# EAGLE design main (EAGLE 6.5.0)
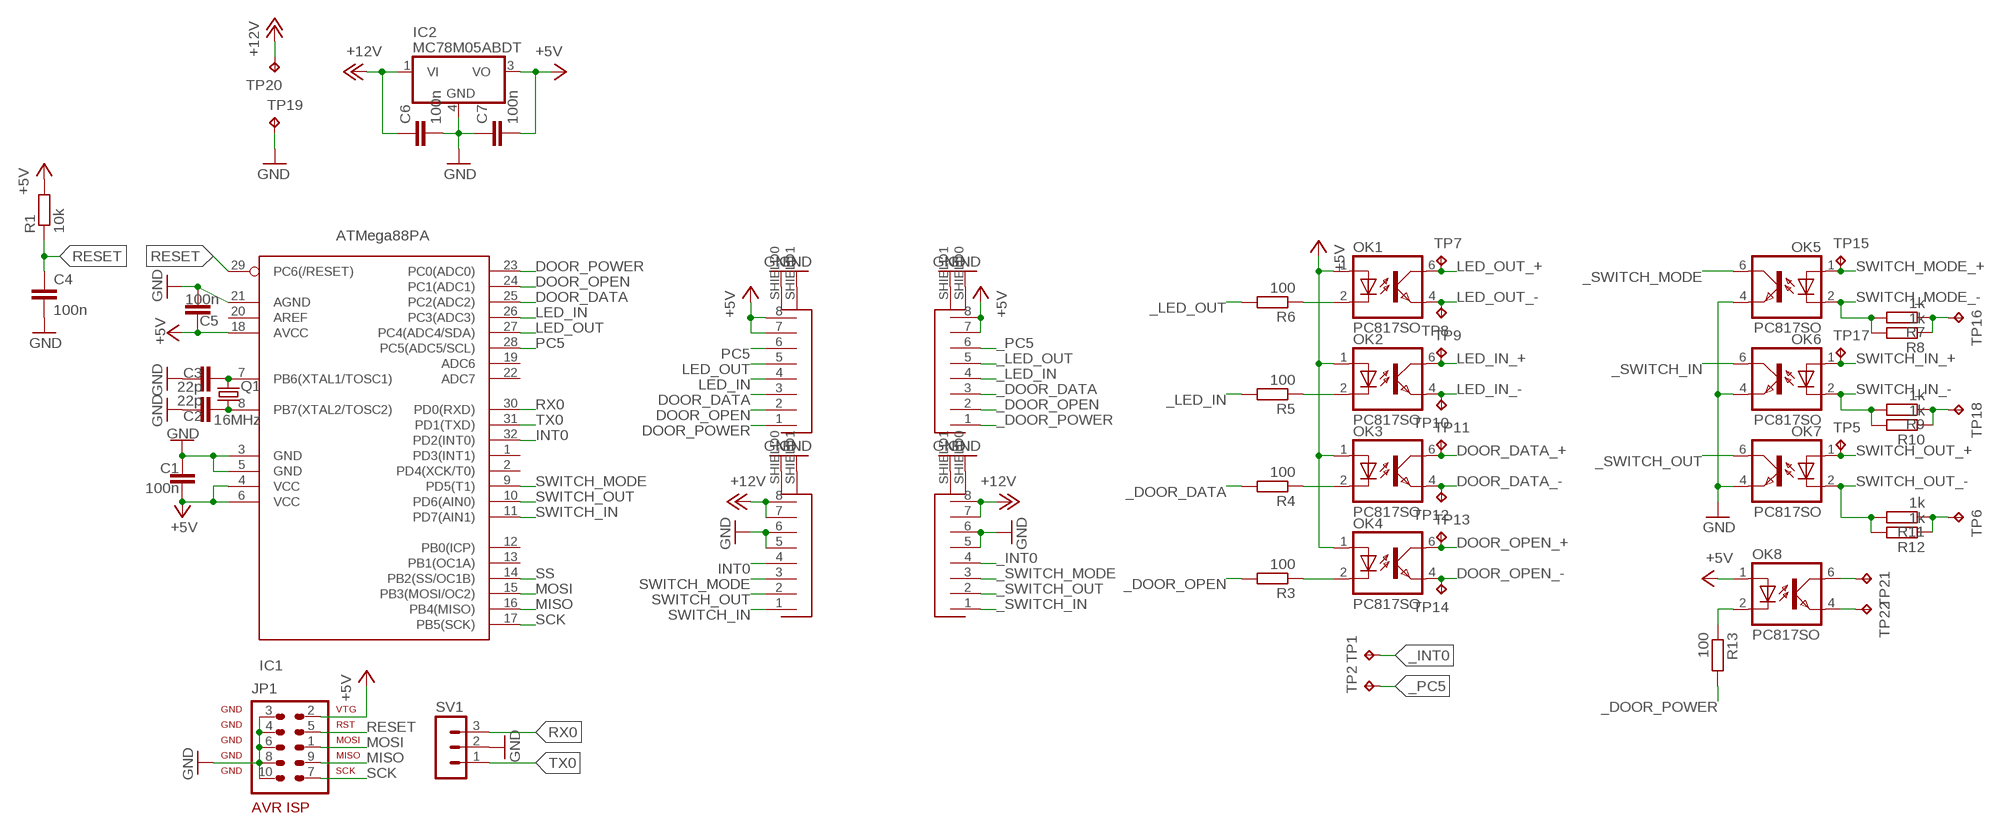
[diagram p0: schematic, sheet 1]

## Parts
C1  100n  C-EUC0805  [C0805]
C2  22p  C-EUC0805  [C0805]
C3  22p  C-EUC0805  [C0805]
C4  100n  C-EUC0805  [C0805]
C5  100n  C-EUC0805  [C0805]
C6  100n  C-EUC0805  [C0805]
C7  100n  C-EUC0805  [C0805]
CON1  451000  [451000]
CON1_  451000  [451000]
CON2  451000  [451000]
CON2_  451000  [451000]
IC1  ATMega88PA  MEGA8-AI  [TQFP32-08]
IC2  MC78M05ABDT  [DPACK_3]
JP1  AVR-ISP-10  [AVR-ISP-10]
OK1  PC817SO  [SO4]
OK2  PC817SO  [SO4]
OK3  PC817SO  [SO4]
OK4  PC817SO  [SO4]
OK5  PC817SO  [SO4]
OK6  PC817SO  [SO4]
OK7  PC817SO  [SO4]
OK8  PC817SO  [SO4]
Q1  16MHz  CRYSTALMQ  [MQ]
R1  10k  R-EU_M0805  [M0805]
R3  100  R-EU_M0805  [M0805]
R4  100  R-EU_M0805  [M0805]
R5  100  R-EU_M0805  [M0805]
R6  100  R-EU_M0805  [M0805]
R7  1k  R-EU_M0805  [M0805]
R8  1k  R-EU_M0805  [M0805]
R9  1k  R-EU_M0805  [M0805]
R10  1k  R-EU_M0805  [M0805]
R11  1k  R-EU_M0805  [M0805]
R12  1k  R-EU_M0805  [M0805]
R13  100  R-EU_M0805  [M0805]
SV1  MA03-1  [MA03-1]
TP1  TPTP20SQ  [TP20SQ]
TP2  TPTP20SQ  [TP20SQ]
TP5  TPTP20SQ  [TP20SQ]
TP6  TPTP20SQ  [TP20SQ]
TP7  TPTP20SQ  [TP20SQ]
TP8  TPTP20SQ  [TP20SQ]
TP9  TPTP20SQ  [TP20SQ]
TP10  TPTP20SQ  [TP20SQ]
TP11  TPTP20SQ  [TP20SQ]
TP12  TPTP20SQ  [TP20SQ]
TP13  TPTP20SQ  [TP20SQ]
TP14  TPTP20SQ  [TP20SQ]
TP15  TPTP20SQ  [TP20SQ]
TP16  TPTP20SQ  [TP20SQ]
TP17  TPTP20SQ  [TP20SQ]
TP18  TPTP20SQ  [TP20SQ]
TP19  TPTP20SQ  [TP20SQ]
TP20  TPTP20SQ  [TP20SQ]
TP21  TPTP20SQ  [TP20SQ]
TP22  TPTP20SQ  [TP20SQ]

## Nets
+5V: C1.1 C5.1 C7.2 CON2.7 CON2.8 CON2_.7 CON2_.8 IC1.4(VCC) IC1.6(VCC) IC1.18(AVCC) IC2.3(VO) JP1.2 OK1.1(A) OK2.1(A) OK3.1(A) OK4.1(A) OK8.1(A) R1.2
+12V: C6.1 CON1.7 CON1.8 CON1_.7 CON1_.8 IC2.1(VI) TP20.TP
_DOOR_DATA: CON2_.3 R4.2
_DOOR_OPEN: CON2_.2 R3.2
_DOOR_POWER: CON2_.1 R13.2
_INT0: CON1_.4 TP1.TP
_LED_IN: CON2_.4 R5.2
_LED_OUT: CON2_.5 R6.2
_PC5: CON2_.6 TP2.TP
_SWITCH_IN: CON1_.1 OK6.6(COL)
_SWITCH_MODE: CON1_.3 OK5.6(COL)
_SWITCH_OUT: CON1_.2 OK7.6(COL)
DOOR_DATA: CON2.3 IC1.25(PC2(ADC2))
DOOR_DATA_+: OK3.6(COL) TP11.TP
DOOR_DATA_-: OK3.4(EMIT) TP12.TP
DOOR_OPEN: CON2.2 IC1.24(PC1(ADC1))
DOOR_OPEN_+: OK4.6(COL) TP13.TP
DOOR_OPEN_-: OK4.4(EMIT) TP14.TP
DOOR_POWER: CON2.1 IC1.23(PC0(ADC0))
GND: C1.2 C2.1 C3.1 C4.2 C5.2 C6.2 C7.1 CON1.5 CON1.6 CON1.SHIELD0 CON1.SHIELD1 CON1_.5 CON1_.6 CON1_.SHIELD0 CON1_.SHIELD1 CON2.SHIELD0 CON2.SHIELD1 CON2_.SHIELD0 CON2_.SHIELD1 IC1.3(GND) IC1.5(GND) IC1.21(AGND) IC2.4(GND) JP1.3 JP1.4 JP1.6 JP1.8 JP1.10 OK5.4(EMIT) OK6.4(EMIT) OK7.4(EMIT) SV1.2 TP19.TP
INT0: CON1.4 IC1.32(PD2(INT0))
LED_IN: CON2.4 IC1.26(PC3(ADC3))
LED_IN_+: OK2.6(COL) TP9.TP
LED_IN_-: OK2.4(EMIT) TP10.TP
LED_OUT: CON2.5 IC1.27(PC4(ADC4/SDA))
LED_OUT_+: OK1.6(COL) TP7.TP
LED_OUT_-: OK1.4(EMIT) TP8.TP
MISO: IC1.16(PB4(MISO)) JP1.9
MOSI: IC1.15(PB3(MOSI/OC2)) JP1.1
N$1: OK8.2(C) R13.1
N$2: OK4.2(C) R3.1
N$3: C3.2 IC1.7(PB6(XTAL1/TOSC1)) Q1.P3
N$4: C2.2 IC1.8(PB7(XTAL2/TOSC2)) Q1.P1
N$5: OK3.2(C) R4.1
N$6: OK2.2(C) R5.1
N$7: OK1.2(C) R6.1
N$10: R7.1 R8.1 TP16.TP
N$11: R11.1 R12.1 TP6.TP
N$12: R9.1 R10.1 TP18.TP
N$13: OK8.6(COL) TP21.TP
N$14: OK8.4(EMIT) TP22.TP
PC5: CON2.6 IC1.28(PC5(ADC5/SCL))
RESET: C4.1 IC1.29(PC6(/RESET)) JP1.5 R1.1
RX0: IC1.30(PD0(RXD)) SV1.3
SCK: IC1.17(PB5(SCK)) JP1.7
SS: IC1.14(PB2(SS/OC1B))
SWITCH_IN: CON1.1 IC1.11(PD7(AIN1))
SWITCH_IN_+: OK6.1(A) TP17.TP
SWITCH_IN_-: OK6.2(C) R9.2 R10.2
SWITCH_MODE: CON1.3 IC1.9(PD5(T1))
SWITCH_MODE_+: OK5.1(A) TP15.TP
SWITCH_MODE_-: OK5.2(C) R7.2 R8.2
SWITCH_OUT: CON1.2 IC1.10(PD6(AIN0))
SWITCH_OUT_+: OK7.1(A) TP5.TP
SWITCH_OUT_-: OK7.2(C) R11.2 R12.2
TX0: IC1.31(PD1(TXD)) SV1.1
Unconnected: IC1.1(PD3(INT1)) IC1.2(PD4(XCK/T0)) IC1.12(PB0(ICP)) IC1.13(PB1(OC1A)) IC1.19(ADC6) IC1.20(AREF) IC1.22(ADC7) Q1.P2(GND) Q1.P4(GND1)

## Library data of the parts
C1-C7 = rcl:C-EU: CAPACITOR, European symbol
CON1 CON1_ CON2 CON2_ = pollin:451000
IC1 = avr-7:MEGA8: MICROCONTROLLER 8 Kbytes FLASH 1 kbytes SRAM 512 bytes EEPROM USART 6-channel 10 bit ADC 2-channel 8 bit ADC
IC2 = linear:MC78M: 500 mA Positive Voltage Regulators Source: Data sheet <http://www.onsemi.com/pub_link/Collateral/MC78M00-D.PDF>
JP1 = avr-7:AVR-ISP-10: AVR ISP-10 Serial Programming Header
OK1-OK8 = optocoupler2:PC817: SHARP OPTO COUPLER
Q1 = crystal2:CRYSTAL
R1 R3-R13 = rcl:R-EU_: RESISTOR, European symbol
SV1 = con-lstb:MA03-1: PIN HEADER; OC_FARNELL: unknown; OC_NEWARK: unknown
TP1 TP2 TP5-TP22 = testpad:TP: Test pad

## Board
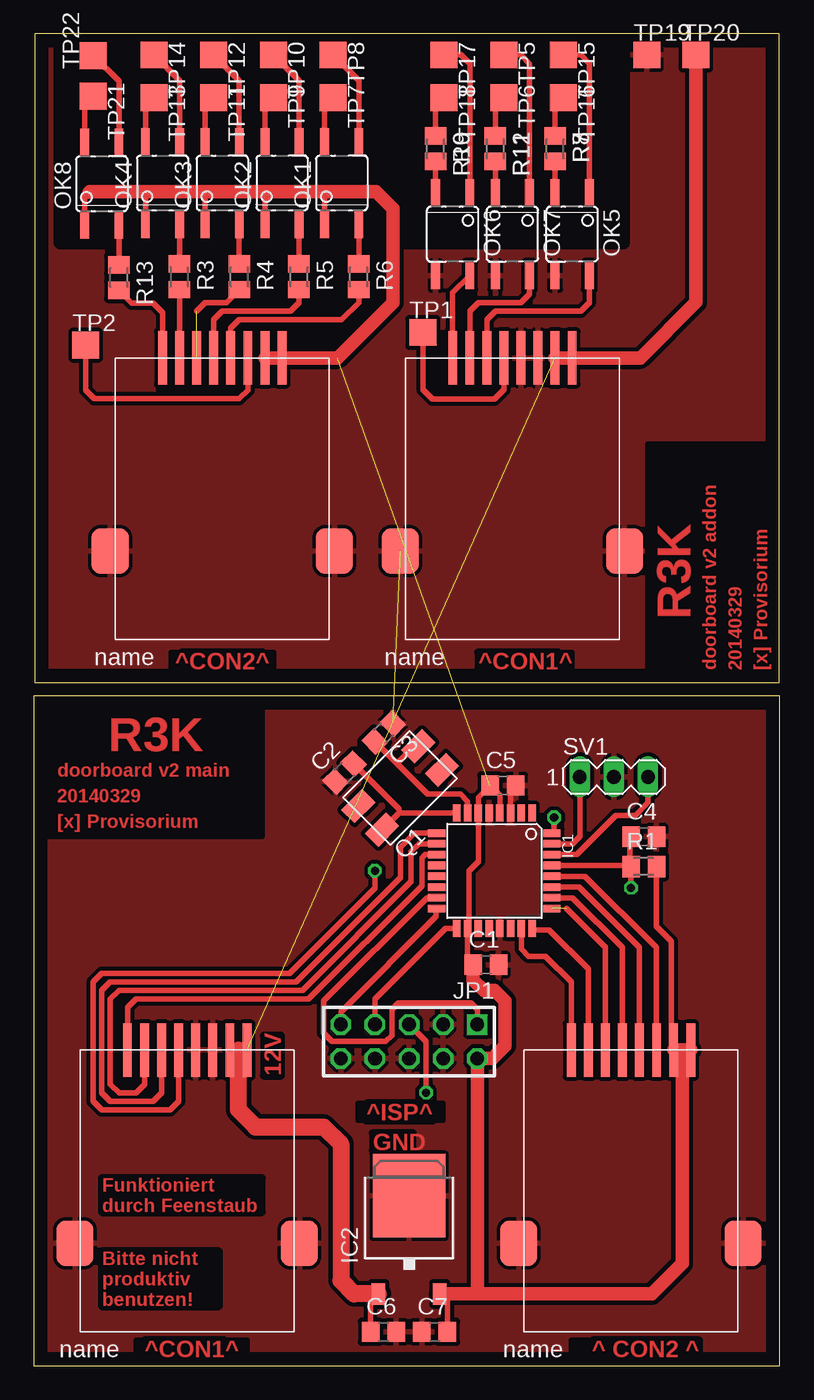
[diagram p1: board, top side]
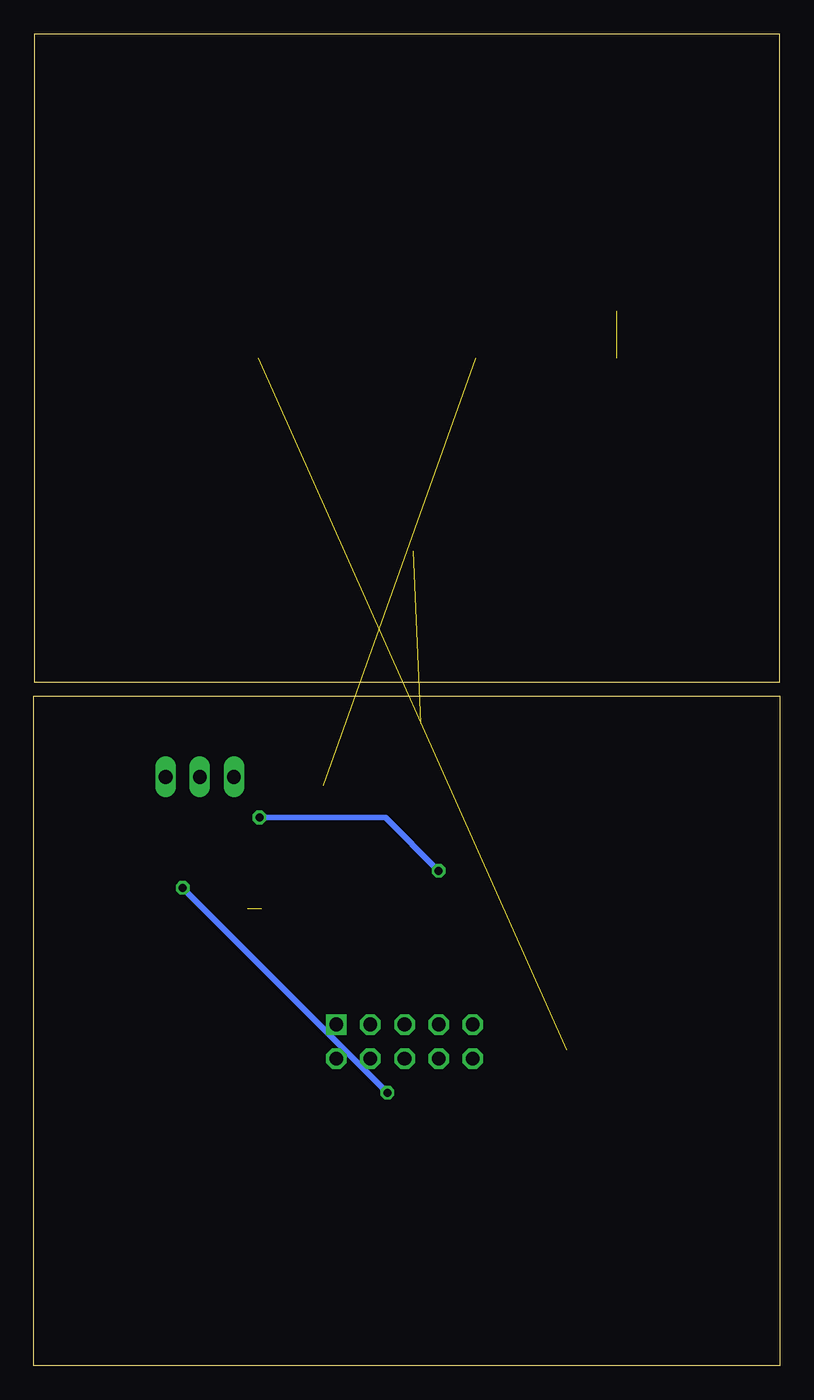
[diagram p2: board, bottom side, seen from below]

Size 55.54 x 99.11 mm. Coordinates in mm from the lower left corner, seen from the top.
Outline: 0,0 55.54,0 55.54,49.84 0,49.84 0,0
Outline: 0.07,50.85 55.47,50.85 55.47,99.11 0.07,99.11 0.07,50.85
Copper layers (1*16): Top 0.035mm / dielectric 1.5mm / Bottom 0.035mm
Design rules "default *": minimum track width 10mil, minimum drill 24mil, track to track 12mil, track to pad 12mil, pad to pad 12mil, via to via 16mil, smd to smd 8mil, copper to edge 40mil, drill to drill 8mil, minimum pad ring 10mil, minimum via ring 8mil, stop-mask expansion 4mil, vias tented up to drill 0mil, thermal gap 10mil
tRestrict: area 1.1,39.4 to 17,48.9; area 40,0.6 to 49.5,1.9; area 7.6,0.6 to 15.9,1.9; area 24.1,18.3 to 30.5,19.5; area 10.2,51.8 to 17.8,53.1; area 33.1,51.8 to 40.1,53.1; area 2,83.6 to 43.9,98.3; area 45.7,51.1 to 55.2,68.6

### Footprints (pad centres in the part's own frame; a part is rotated, then mirrored left to right if it is on the bottom)
C0805 = smd 1.3 x 1.5: 1 -0.95,0; 2 0.95,0
451000 = smd 0.66 x 3.962: 1 -4.445,4.445; 2 -3.175,4.445; 3 -1.905,4.445; 4 -0.635,4.445; 5 0.635,4.445; 6 1.905,4.445; 7 3.175,4.445; 8 4.445,4.445 | smd 2.769 x 3.378: SHIELD0 -8.344,-9.931; SHIELD1 8.344,-9.931
TQFP32-08 = smd 1.27 x 0.559: 1 -4.293,2.8; 2 -4.293,2; 3 -4.293,1.2; 4 -4.293,0.4; 5 -4.293,-0.4; 6 -4.293,-1.2; 7 -4.293,-2; 8 -4.293,-2.8; 17 4.293,-2.8; 18 4.293,-2; 19 4.293,-1.2; 20 4.293,-0.4; 21 4.293,0.4; 22 4.293,1.2; 23 4.293,2; 24 4.293,2.8 | smd 0.559 x 1.27: 9 -2.8,-4.293; 10 -2,-4.293; 11 -1.2,-4.293; 12 -0.4,-4.293; 13 0.4,-4.293; 14 1.2,-4.293; 15 2,-4.293; 16 2.8,-4.293; 25 2.8,4.293; 26 2,4.293; 27 1.2,4.293; 28 0.4,4.293; 29 -0.4,4.293; 30 -1.2,4.293; 31 -2,4.293; 32 -2.8,4.293
DPACK_3 = smd 1 x 1.6: 1 -2.28,-4.8; 3 2.28,-4.8 | smd 5.4 x 6.2: 4 0,2.5
AVR-ISP-10 = drill 1.016 square: 1 -5.08,-1.27 | drill 1.016 octagon: 2 -5.08,1.27; 3 -2.54,-1.27; 4 -2.54,1.27; 5 0,-1.27; 6 0,1.27; 7 2.54,-1.27; 8 2.54,1.27; 9 5.08,-1.27; 10 5.08,1.27
SO4 = smd 0.66 x 2.032: 1 -0.635,-3.073; 2 1.905,-3.073; 4 1.905,3.073; 6 -0.635,3.073
MQ = smd 2.2 x 1.4: P1 -3.15,-1.25; P2 3.15,-1.25; P3 3.15,1.25; P4 -3.15,1.25
M0805 = smd 1.3 x 1.6: 1 -0.95,0; 2 0.95,0
MA03-1 = drill 1.016 long: 1 -2.54,0; 2 0,0; 3 2.54,0
TP20SQ = smd 2 x 2: TP 0,0

### Placement (x,y rotation side)
C1  33.66,29.84 0 top
C2  23.13,44.14 45 top
C3  26.06,47.12 225 top
C4  45.4,39.37 0 top
C5  34.92,43.18 0 top
C6  26.04,2.54 0 top
C7  29.84,2.54 0 top
CON1  11.43,19.05 0 top
CON1_  35.63,70.54 0 top
CON2  44.45,19.05 0 top
CON2_  14.04,70.54 0 top
IC1  34.29,36.83 270 top
IC2  27.94,10.16 0 top
JP1  27.94,24.13 180 top
OK1  22.29,88 0 top
OK2  17.85,88 0 top
OK3  13.4,88 0 top
OK4  8.96,88 0 top
OK5  40.71,84.19 180 top
OK6  31.82,84.19 180 top
OK7  36.26,84.19 180 top
OK8  4.45,87.95 0 top
Q1  27.28,42.99 45 top
R1  45.4,37.15 0 top
R3  10.86,81.02 270 top
R4  15.31,81.02 270 top
R5  19.75,81.02 270 top
R6  24.2,81.02 270 top
R7  38.8,90.54 270 top
R8  38.8,90.54 270 top
R9  29.91,90.54 270 top
R10  29.91,90.54 270 top
R11  34.36,90.54 270 top
R12  34.36,90.54 270 top
R13  6.35,80.96 270 top
SV1  43.18,43.81 0 top
TP1  28.96,76.89 0 top
TP2  3.88,75.94 0 top
TP5  34.99,97.53 270 top
TP6  34.99,94.35 270 top
TP7  22.29,94.35 270 top
TP8  22.29,97.53 270 top
TP9  17.85,94.35 270 top
TP10  17.85,97.53 270 top
TP11  13.4,94.35 270 top
TP12  13.4,97.53 270 top
TP13  8.96,94.35 270 top
TP14  8.96,97.53 270 top
TP15  39.44,97.53 270 top
TP16  39.44,94.35 270 top
TP17  30.55,97.53 270 top
TP18  30.55,94.35 270 top
TP19  45.63,97.53 0 top
TP20  49.28,97.53 0 top
TP21  4.45,94.46 270 top
TP22  4.45,97.47 90 top

### Tracks (layer width: path | path; a pad name or v marks a point on that pad's centre or on a via)
+5V  (1 unrouted)
  Top 0.406: C7.2 30.8,4.79 IC2.3 | IC1.4 34.69,42.47 C5.1 33.09,42.3 IC1.6 33.09,37.53 32.38,36.83 32.38,32.63 IC1.18 32.29,30.26 C1.1 | OK1.1 21.66,87.36 | OK2.1 17.21,86.73 17.85,87.36 | OK3.1 12.77,87.36 | OK4.1 8.32,87.36 | R1.2 46.35,32.7 47.47,31.59 47.47,23.65 CON2.7 | OK8.1 3.81,87 4.13,87.31
  Top 1.016: CON2_.8 CON2_.7 22.61,74.98 26.74,79.11 26.74,86.09 25.47,87.36 21.66,87.36 17.85,87.36 12.77,87.36 8.32,87.36 4.18,87.36 4.13,87.31 | CON2.7 48.26,23.5 | 48.26,23.5 CON2.8 | C1.1 32.7,28.73 33.5,27.94 34.29,27.94 35.08,27.15 35.08,23.81 34.13,22.86 JP1.2 33.02,5.36 | IC2.3 33.02,5.36 | 33.02,5.36 46,5.36 48.26,7.62 48.26,23.5
+12V  (1 unrouted)
  Top 0.406: C6.1 25.09,4.79 IC2.1 | CON1.8 15.24,23.5 CON1.7
  Top 1.016: CON1_.7 CON1_.8 45.14,74.98 49.28,79.13 TP20.TP
  Top 1.27: IC2.1 23.85,5.36 22.86,6.35 22.86,16.51 21.59,17.78 16.51,17.78 15.24,19.05 15.24,23.5
_DOOR_DATA  (1 unrouted)
  Top 0.406: 12.13,78.47 12.77,79.11 14.35,79.11 R4.2
_DOOR_OPEN
  Top 0.406: CON2_.2 R3.2
_DOOR_POWER
  Top 0.406: R13.2 7.3,79.06 8.89,79.06 9.59,78.35 CON2_.1
_INT0
  Top 0.406: TP1.TP 28.96,72.64 29.69,71.91 34.29,71.91 34.99,72.62 CON1_.4
_LED_IN
  Top 0.406: R5.2 19.75,79.11 19.12,78.47 14.04,78.47 13.4,77.84 CON2_.4
_LED_OUT
  Top 0.406: R6.2 24.2,79.11 22.93,77.84 15.31,77.84 14.67,77.2 CON2_.5
_PC5
  Top 0.406: CON2_.6 15.94,72.6 15.31,71.97 4.51,71.97 3.88,72.6 TP2.TP
_SWITCH_IN
  Top 0.406: OK6.6 31.18,79.85 CON1_.1
_SWITCH_MODE
  Top 0.406: OK5.6 41.34,79.11 40.71,78.47 34.36,78.47 33.72,77.84 CON1_.3
_SWITCH_OUT
  Top 0.406: OK7.6 36.9,79.75 36.26,79.11 33.09,79.11 32.45,78.47 CON1_.2
DOOR_DATA  (1 unrouted)
  Top 0.406: CON2.3 42.55,31.11 39.63,34.03
DOOR_DATA_+
  Top 0.406: OK3.6 12.77,93.72 TP11.TP
DOOR_DATA_-
  Top 0.406: OK3.4 15.31,95.62 TP12.TP
DOOR_OPEN
  Top 0.406: CON2.2 41.27,29.53 38.36,32.44 37.09,32.44 IC1.24
DOOR_OPEN_+
  Top 0.406: OK4.6 8.32,93.72 TP13.TP
DOOR_OPEN_-
  Top 0.406: OK4.4 10.86,95.62 TP14.TP
DOOR_POWER
  Top 0.406: CON2.1 40.01,28.57 38.1,30.48 36.83,30.48 36.29,31.02 IC1.23
GND  (1 unrouted)
  Top 0.406: IC1.3 35.49,42.8 C5.2
  pour Top: -1.27,50.16 56.52,50.16 56.52,-0.64 -1.27,-0.64
  pour Top: -1.04,99.59 -1.2,50.22 55.95,50.22 56.11,99.59
INT0  (via drill 0.6)
  Top 0.406: CON1.4 10.79,19.68 10.16,19.05 5.08,19.05 4.45,19.68 4.45,28.57 5.08,29.21 19.05,29.21 25.4,35.56 v25.4,36.83 | v38.73,40.8 38.73,39.78 IC1.32
  Bottom 0.406: v25.4,36.83 29.37,40.8 v38.73,40.8
LED_IN
  Top 0.406: CON2.4 43.81,31.11 40.1,34.83 IC1.26
LED_IN_+
  Top 0.406: OK2.6 17.21,93.72 TP9.TP
LED_IN_-
  Top 0.406: OK2.4 19.75,95.62 TP10.TP
LED_OUT
  Top 0.406: CON2.5 45.09,31.11 40.57,35.63 IC1.27
LED_OUT_+
  Top 0.406: OK1.6 21.66,93.72 TP7.TP
LED_OUT_-
  Top 0.406: OK1.4 24.2,95.62 TP8.TP
MISO
  Top 0.406: JP1.9 22.86,26.35 29.94,33.43 29.94,33.97 IC1.16
MOSI
  Top 0.406: JP1.1 33.02,26.51 32.54,26.99 27.15,26.99 26.67,26.51 26.67,24.61 26.19,24.13 22.23,24.13 21.59,24.77 21.59,27.15 29.27,34.83 IC1.15
N$1
  Top 0.406: R13.1 OK8.2
N$2
  Top 0.406: R3.1 OK4.2
N$3
  Top 0.406: IC1.7 32.29,42.01 31.75,42.55 29.3,42.55 27.03,44.81 | 27.03,44.81 C3.2 | Q1.P3 28.32,46.1 27.03,44.81
N$4
  Top 0.406: IC1.8 27.17,41.12 | 27.17,41.12 Q1.P1 | C2.2 27.17,41.44 27.17,41.12
N$5
  Top 0.406: R4.1 OK3.2
N$6
  Top 0.406: R5.1 OK2.2
N$7
  Top 0.406: R6.1 OK1.2
N$10
  Top 0.406: R8.1 38.8,93.72 TP16.TP
N$11
  Top 0.406: R12.1 34.36,94.35 TP6.TP
N$12
  Top 0.406: R10.1 29.91,93.72 TP18.TP
N$13
  Top 0.406: OK8.6 3.81,93.82 TP21.TP
N$14
  Top 0.406: OK8.4 6.35,95.57 TP22.TP
PC5
  Top 0.406: CON2.6 46.35,31.11 41.04,36.43 IC1.28
RESET  (via drill 0.6)
  Top 0.406: v29.21,20.32 29.21,24.13 JP1.5 | IC1.29 44.37,37.23 | 44.37,37.23 R1.1 v44.45,35.56 | 44.37,37.23 44.37,39.29 C4.1
  Bottom 0.406: v29.21,20.32 v44.45,35.56
RX0
  Top 0.406: IC1.30 40.41,38.03 43.34,40.96 44.77,40.96 45.72,41.91 SV1.3
SCK
  Top 0.406: IC1.17 30.63,32.54 25.4,27.3 JP1.7
SWITCH_IN
  Top 0.406: CON1.1 6.99,26.67 7.62,27.3 20.48,27.3 28.89,35.72 28.89,37.78 29.14,38.03 IC1.11
SWITCH_IN_+
  Top 0.406: OK6.1 32.45,96.89 31.82,97.53 TP17.TP
SWITCH_IN_-
  Top 0.406: OK6.2 R10.2
SWITCH_MODE
  Top 0.406: CON1.3 9.53,20.32 8.89,19.68 5.71,19.68 5.08,20.32 5.08,27.94 5.71,28.57 19.53,28.57 27.3,36.35 27.3,38.58 28.36,39.63 IC1.9
SWITCH_MODE_+
  Top 0.406: OK5.1 41.34,96.89 40.71,97.53 TP15.TP
SWITCH_MODE_-
  Top 0.406: OK5.2 R8.2
SWITCH_OUT
  Top 0.406: CON1.2 8.26,20.95 7.62,20.32 6.35,20.32 5.71,20.95 5.71,27.3 6.35,27.94 20,27.94 28.1,36.04 28.1,38.26 28.67,38.83 IC1.10
SWITCH_OUT_+
  Top 0.406: OK7.1 36.9,96.89 36.26,97.53 TP5.TP
SWITCH_OUT_-
  Top 0.406: OK7.2 R11.2
TX0
  Top 0.406: IC1.31 40.1,38.83 40.64,39.37 SV1.1

### Text on the board
Top: R3K | ^CON2^ | ^CON1^ | doorboard v2 addon | 20140329 | [x] Provisorium | R3K | doorboard v2 main | 20140329 | [x] Provisorium | 12V | ^ISP^ | GND | Funktioniert / durch Feenstaub | Bitte nicht / produktiv / benutzen! | ^ CON2 ^ | ^CON1^
200bmp: /tmp/knoten.bmp